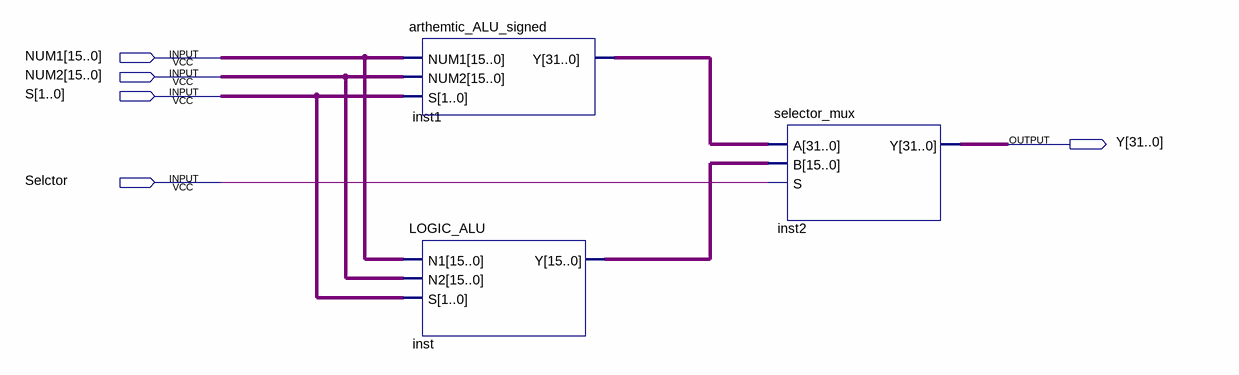
[diagram p0: schematic sheet]
// Quartus schematic microprocessor.bdf as structural Verilog: 3 symbols, 5 pins
module microprocessor (
  input  [15:0] NUM1,
  input  [15:0] NUM2,
  input  [1:0] S,
  input  Selctor,
  output [31:0] Y
);

  wire [15:0] inst_y;
  wire [31:0] inst1_y;

  arthemtic_ALU_signed inst1 (.NUM1(NUM1), .NUM2(NUM2), .S(S), .Y(inst1_y));
  LOGIC_ALU inst (.N1(NUM1), .N2(NUM2), .S(S), .Y(inst_y));
  selector_mux inst2 (.A(inst1_y), .B(inst_y), .S(Selctor), .Y(Y));
endmodule
